# EAGLE design TPS61165 (EAGLE 9.6.2)
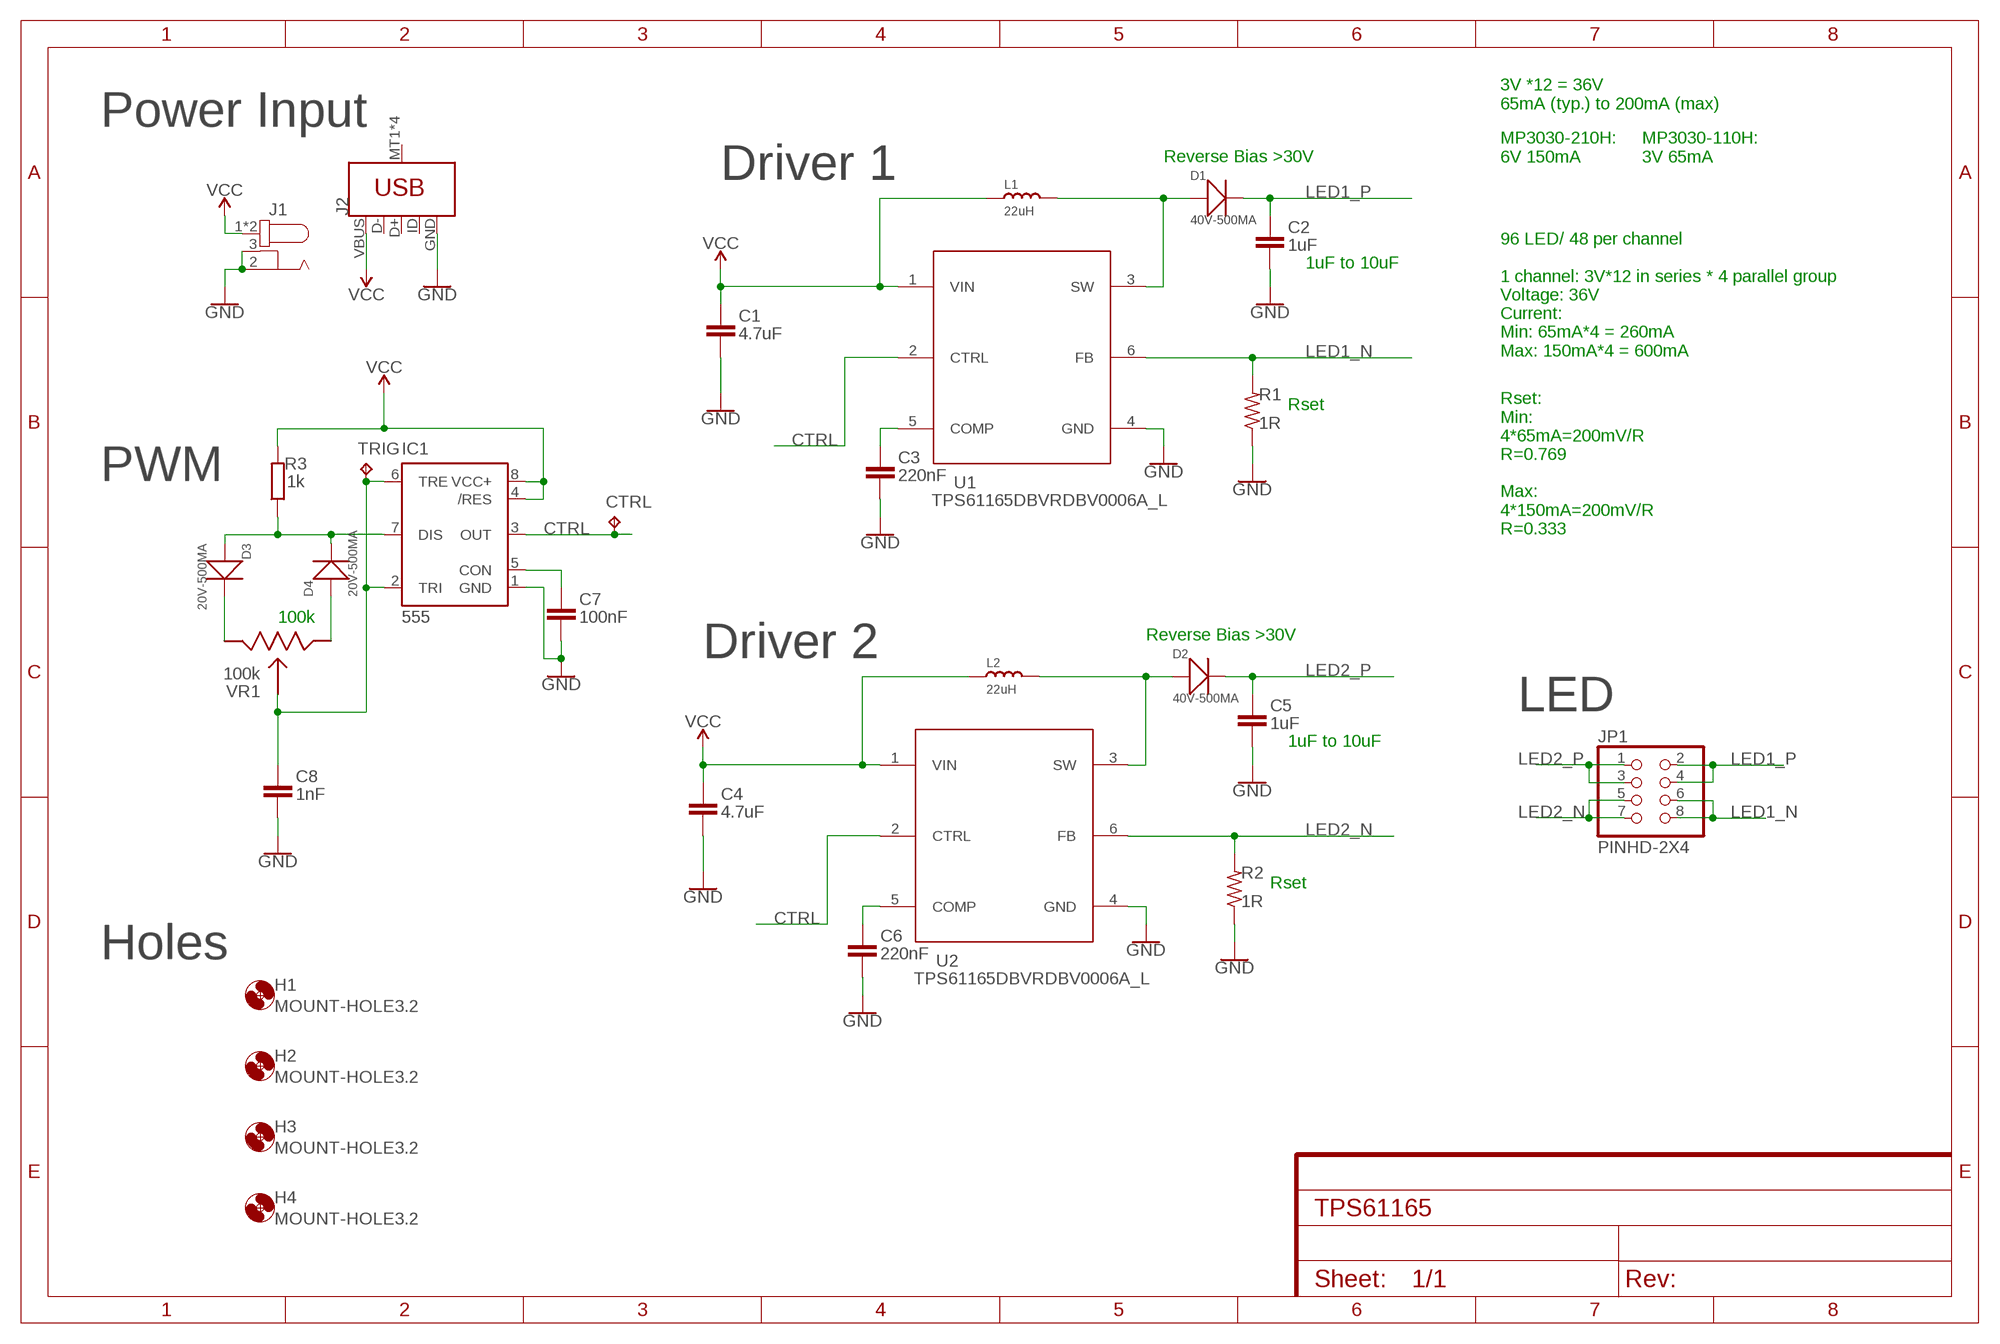
[diagram p0: schematic, sheet 1]

## Parts
C1  4.7uF  C_CHIP-0805(2012-METRIC)  [CAPC2012X110]
C2  1uF  C_CHIP-0805(2012-METRIC)  [CAPC2012X110]
C3  220nF  C_CHIP-0603(1608-METRIC)  [CAPC1608X85]
C4  4.7uF  C_CHIP-0805(2012-METRIC)  [CAPC2012X110]
C5  1uF  C_CHIP-0805(2012-METRIC)  [CAPC2012X110]
C6  220nF  C_CHIP-0603(1608-METRIC)  [CAPC1608X85]
C7  100nF  C_CHIP-0603(1608-METRIC)  [CAPC1608X85]
C8  1nF  C_CHIP-0603(1608-METRIC)  [CAPC1608X85]
CTRL  TPB1,27  [B1,27]
D1  40V-500MA  SMD-DIODE-SCHOTTKY-40V-500MA(SOD-123)  [SOD-123]
D2  40V-500MA  SMD-DIODE-SCHOTTKY-40V-500MA(SOD-123)  [SOD-123]
D3  20V-500MA  SMD-DIODE-SCHOTTKY-20V-500MA(SOD-123)  [SOD-123]
D4  20V-500MA  SMD-DIODE-SCHOTTKY-20V-500MA(SOD-123)  [SOD-123]
H1  MOUNT-HOLE3.2  [3,2]
H2  MOUNT-HOLE3.2  [3,2]
H3  MOUNT-HOLE3.2  [3,2]
H4  MOUNT-HOLE3.2  [3,2]
IC1  555  555D  [SO08]
J1  694108106102  [694108106102]
J2  USB_MICRO-B_SMT  [USB-MICROB]
JP1  PINHD-2X4  [2X04]
L1  22uH  SMD-INDUCTOR-10UH-20%(2P-6X6MM)'0630'  [SMD-2P-L6.0XW6.0XH3.0MM]
L2  22uH  SMD-INDUCTOR-10UH-20%(2P-6X6MM)'0630'  [SMD-2P-L6.0XW6.0XH3.0MM]
R1  1R  R-US_CHIP-1206(3216-METRIC)  [RESC3216X70]
R2  1R  R-US_CHIP-1206(3216-METRIC)  [RESC3216X70]
R3  1k  R_CHIP-0603(1608-METRIC)  [RESC1608X60]
TRIG  TPB1,27  [B1,27]
U1  TPS61165DBVRDBV0006A_L  [DBV0006A_L]
U2  TPS61165DBVRDBV0006A_L  [DBV0006A_L]
VR1  100k  5PIN-POT  [B104-5PIN]

## Nets
COMP: C3.1 U1.5(COMP)
COMP1: C6.1 U2.5(COMP)
CON: C7.1 IC1.5(CON)
CTRL: CTRL.TP IC1.3(OUT) U1.2(CTRL) U2.2(CTRL)
DISCHARGE: D3.+ D4.- IC1.7(DIS) R3.1
GND: C1.2 C2.2 C3.2 C4.2 C5.2 C6.2 C7.2 C8.2 IC1.1(GND) J1.2 J1.3 J2.GND R1.1 R2.1 U1.4(GND) U2.4(GND)
LED1_N: JP1.6 JP1.8 R1.2 U1.6(FB)
LED1_P: C2.1 D1.- JP1.2 JP1.4
LED2_N: JP1.5 JP1.7 R2.2 U2.6(FB)
LED2_P: C5.1 D2.- JP1.1 JP1.3
N$9: D3.- VR1.P$3
N$10: D4.+ VR1.P$1
SW: D1.+ L1.2 U1.3(SW)
SW1: D2.+ L2.2 U2.3(SW)
TRIGGER: C8.1 IC1.2(TRI) IC1.6(TRE) TRIG.TP VR1.NOT_P$2
VCC: C1.1 C4.1 IC1.4(/RES) IC1.8(VCC+) J1.1 J1.A1 J2.VBUS L1.1 L2.1 R3.2 U1.1(VIN) U2.1(VIN)
Unconnected: J2.D+ J2.D- J2.ID J2.MT1(SHIELD) J2.MT2(SHIELD) J2.P$1(SHIELD) J2.P$2(SHIELD)

## Notes on the sheet
- 3V *12 = 36V
  65mA (typ.) to 200mA (max)
- Power Input
- Reverse Bias >30V
- MP3030-210H:
  6V 150mA
- MP3030-110H:
  3V 65mA
- Driver 1
- 1uF to 10uF
- 96 LED/ 48 per channel
  
  1 channel: 3V*12 in series * 4 parallel group
  Voltage: 36V
  Current:
  Min: 65mA*4 = 260mA
  Max: 150mA*4 = 600mA
- Rset
- PWM
- Rset:
  Min:
  4*65mA=200mV/R
  R=0.769
  
  Max:
  4*150mA=200mV/R
  R=0.333
- 100k
- Reverse Bias >30V
- Driver 2
- LED
- 1uF to 10uF
- Rset
- Holes

## Library data of the parts
C1-C8 = Capacitor:C: Capacitor - Generic; CATEGORY: Capacitor
CTRL TRIG = testpad:TP: Test pad
D1 D2 = OPL_Discrete_Semiconductor:SMD-DIODE-SCHOTTKY-40V-500MA(SOD-123): 304020012; MPN: B0540W
D3 D4 = OPL_Discrete_Semiconductor:SMD-DIODE-SCHOTTKY-20V-500MA(SOD-123): 304020032; MPN: SS0520-7-F
H1-H4 = holes:MOUNT-HOLE: MOUNTING HOLE with drill center marker
IC1 = SparkFun-IC-Special-Function:555: General purpose bipolar Timer Datasheet <http://www.sparkfun.com/datasheets/Components/General/ne555.pdf> SparkFun Products SparkFun SparkPunk Sequencer Kit <https://www.sparkfun.com/products/12707> (KIT-12707) Storefront Component: 555 Timer <https://www.sparkfun.com/products/9273> (COM-09273) Two parts valid for production: VFP: IC-11930 (M7555 PTH) VFP: IC-09173 (555 PTH) - Preferred; PROD_ID: NA-XXXXX
J1 = Connector:694108106102: WR-DC DC Power Jack Right Angled SMT Ø 6.4 with 4 soldering pads & pegs Datasheet <https://katalog.we-online.com/en/em/DC_SMT_RIGHT_ANGLED_6_4_WITH_4_SOLDER_PADS_PEGS_69410X106102>; CATEGORY: Connector; DESCRIPTION: CONN PWR JACK 2.5X5.5MM SOLDER; MANUFACTURER: Würth Elektronik; MOUNT: SMT; MPN: 694108106102; OPERATING_TEMPERATURE: -40°C to +85°C; PART_STATUS: Active; ROHS_COMPLIANCE: RoHS Compliant; SERIES: WR-DC; SUBCATEGORY: Power Connector; TYPE: Barrel-Right Angled
J2 = SparkFun-Connectors:USB_MICRO-B: USB Type Micro-B Connector Male/female and PTH/SMT variants SparkFun Products: SparkFun microB USB Breakout <https://www.sparkfun.com/products/12035> SparkFun USB microB Plug Breakout <https://www.sparkfun.com/products/10031> SparkFun ESP8266 Thing <https://www.sparkfun.com/products/13231>; PROD_ID: CONN-09505; SF_ID: PRT-08533
JP1 = Connector:PINHD-2X4: PIN HEADER; CATEGORY: CONNECTOR; SUB-CATEGORY: PIN-HEADER
L1 L2 = OPL_Inductor:SMD-INDUCTOR-10UH-20%(2P-6X6MM): 303010016; MPN: CSAB0630-100M; VALUE: 10UH
R1 R2 = Resistor:R-US: Resistor Fixed - ANSI; CATEGORY: Resistor; SUB-CATEGORY: Fixed
R3 = Resistor:R: Resistor Fixed - Generic; CATEGORY: Resistor; SUB-CATEGORY: Fixed
U1 U2 = MP3030:TPS61165DBVR; COPYRIGHT: Copyright (C) 2021 Ultra Librarian. All rights reserved.; MANUFACTURER_PART_NUMBER: TPS61165DBVR; MFR_NAME: Texas Instruments; REFDES: RefDes; TYPE: TYPE
VR1 = MP3030:5PIN-POT

## Board
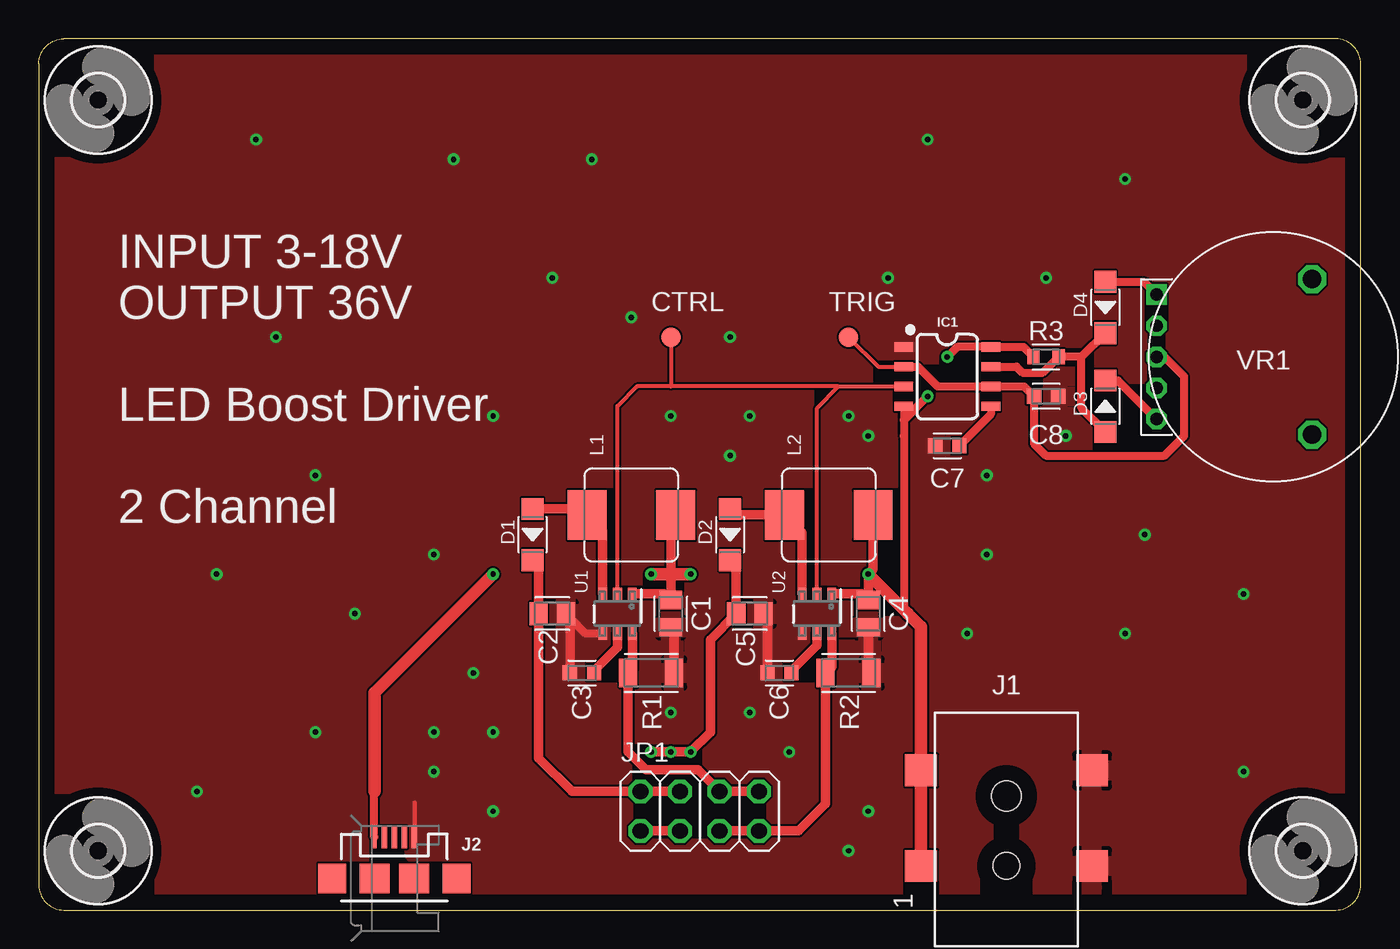
[diagram p1: board, top side]
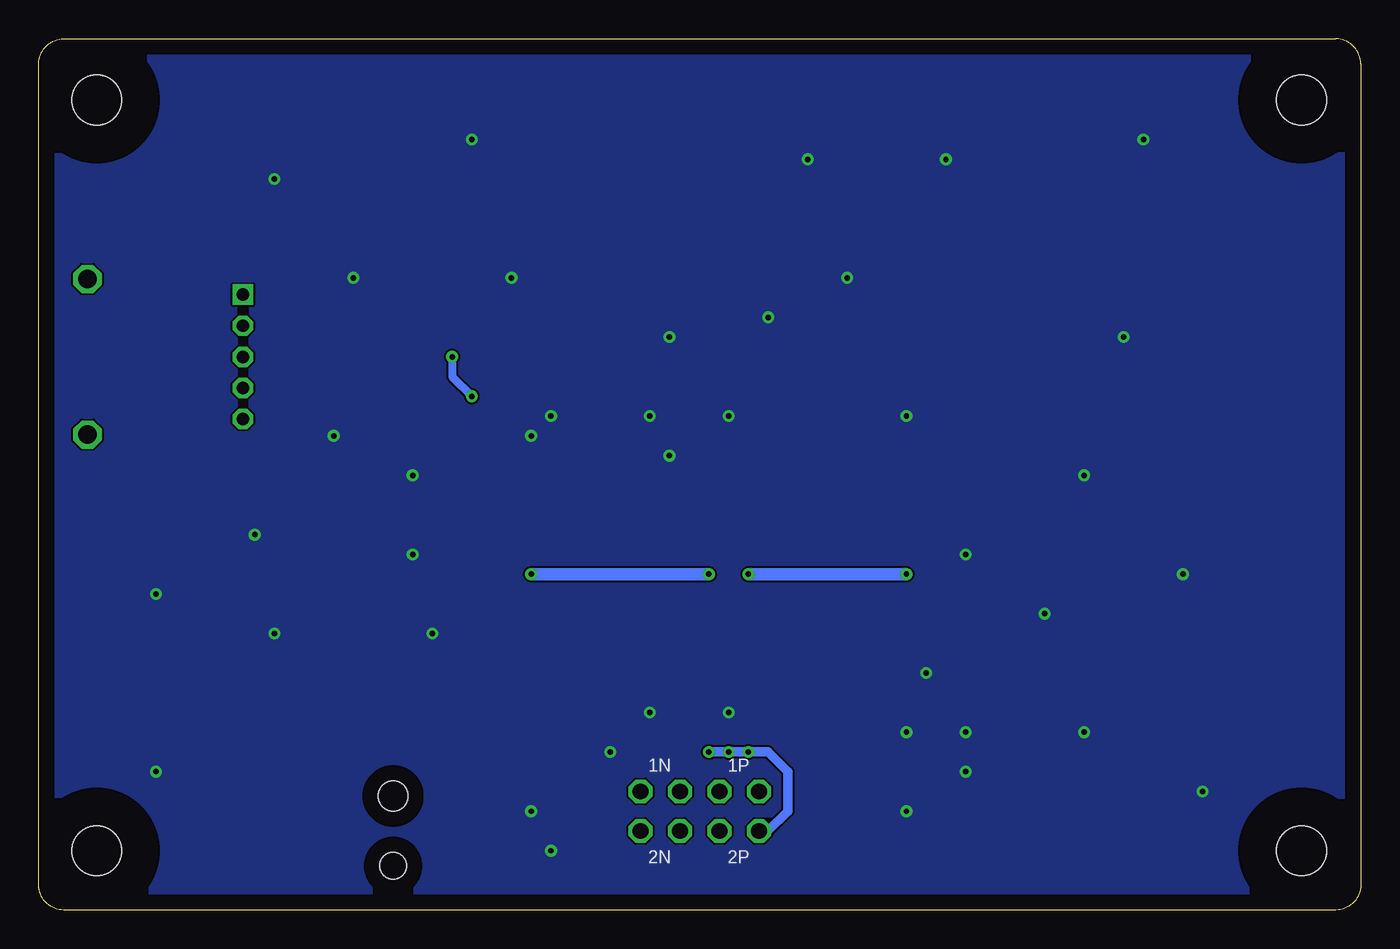
[diagram p2: board, bottom side, seen from below]

Size 85 x 56 mm. Coordinates in mm from the lower left corner, seen from the top.
Outline: 0,54.4 0,1.6 arc90 1.6,0 83.4,0 arc90 85,1.6 85,54.4 arc90 83.4,56 1.6,56 arc90 0,54.4
Copper layers (1*16): Top 0.035mm / dielectric 1.5mm / Bottom 0.035mm
Design rules "default *": minimum track width 6mil, minimum drill 0.35mm, track to track 5mil, track to pad 10mil, pad to pad 20mil, via to via 10mil, smd to smd 6mil, copper to edge 40mil, drill to drill 6mil, minimum pad ring 10mil, minimum via ring 8mil, stop-mask expansion 4mil, vias tented up to drill 0mil, thermal gap 10mil

### Footprints (pad centres in the part's own frame; a part is rotated, then mirrored left to right if it is on the bottom)
CAPC2012X110 = smd 1.165 x 1.465: 1 -0.875,0; 2 0.875,0
CAPC1608X85 = smd 0.921 x 0.97: 1 -0.775,0; 2 0.775,0
B1,27 = smd 1.27 x 1.27: TP 0,0
SOD-123 = smd 1.397 x 1.397: + -1.651,0; - 1.651,0
3,2 = hole 3.2: 0,0
SO08 = smd 0.6 x 1.2: 1 -1.905,-2.8; 2 -0.635,-2.8; 3 0.635,-2.8; 4 1.905,-2.8; 5 1.905,2.8; 6 0.635,2.8; 7 -0.635,2.8; 8 -1.905,2.8
694108106102 = smd 2.05 x 2.05: 1 -2.25,5.5; 2 -2.25,-5.5; 3 3.9,-5.5; A1 3.9,5.5 | hole 1.7: -2.25,0 | hole 1.9: 2.25,0
USB-MICROB = smd 1.4 x 0.35: D+ -2.65,0; D- -2.65,-0.65; GND -2.65,1.3; ID -2.65,0.65; VBUS -2.65,-1.3 | smd 1.9 x 1.8: MT1 0,-4; MT2 0,4 | smd 1.9 x 1.9: P$1 0,-1.27; P$2 0,1.27
2X04 = drill 1.016 octagon: 1 -3.81,-1.27; 2 -3.81,1.27; 3 -1.27,-1.27; 4 -1.27,1.27; 5 1.27,-1.27; 6 1.27,1.27; 7 3.81,-1.27; 8 3.81,1.27
SMD-2P-L6.0XW6.0XH3.0MM = smd 2.5 x 3.2: 1 -2.85,0; 2 2.85,0
RESC3216X70 = smd 1.165 x 1.815: 1 -1.475,0; 2 1.475,0
RESC1608X60 = smd 0.799 x 0.974: 1 -0.815,0; 2 0.815,0
DBV0006A_L = smd 0.8 x 0.55: 1 -1.275,0.95; 2 -1.275,0; 3 -1.275,-0.95; 4 1.275,-0.95; 5 1.275,0; 6 1.275,0.95
B104-5PIN = drill 1.2 octagon: NC1 -5,2.5; NC2 5,2.5 | drill 0.8 octagon: NOT_P$2 0,-7.5; NOT_P$3 2,-7.5; P$2 -2,-7.5; P$3 4,-7.5 | drill 0.8 square: P$1 -4,-7.5

### Placement (x,y rotation side)
C1  40.64,19.05 270 top
C2  33.02,19.05 0 top
C3  34.92,15.24 180 top
C4  53.34,19.05 270 top
C5  45.72,19.05 0 top
C6  47.62,15.24 180 top
C7  58.42,29.84 180 top
C8  64.77,33.02 0 top
CTRL  40.64,36.83 0 top
D1  31.75,24.13 270 top
D2  44.45,24.13 270 top
D3  68.58,32.38 90 top
D4  68.58,38.73 270 top
H1  3.81,3.81 0 top
H2  3.81,52.07 0 top
H3  81.28,52.07 0 top
H4  81.28,3.81 0 top
IC1  58.42,34.29 270 top
J1  62.23,5.08 90 top
J2  22.86,2.03 270 top
JP1  42.5,6.35 0 top
L1  38.1,25.4 180 top
L2  50.8,25.4 180 top
R1  39.37,15.24 180 top
R2  52.07,15.24 180 top
R3  64.77,35.56 180 top
TRIG  52.07,36.83 0 top
U1  37.21,19.05 270 top
U2  50.04,19.05 270 top
VR1  79.38,35.56 270 top

### Tracks (layer width: path | path; a pad name or v marks a point on that pad's centre or on a via)
COMP
  Top 0.61: C3.1 35.7,15.37 37.21,16.88 U1.5
COMP1
  Top 0.61: C6.1 48.4,15.37 50.04,17 U2.5
CON
  Top 0.508: IC1.5 61.22,31.87 C7.1
CTRL
  Top 0.254: U1.2 37.21,32.38 38.48,33.66 40.64,33.66 | U2.2 50.04,32.26 51.44,33.66 | 51.44,33.66 IC1.3 | 51.44,33.66 40.64,33.66 | CTRL.TP 40.64,33.66
DISCHARGE
  Top 0.508: D4.- 67.06,35.56 | 67.06,35.56 R3.1 64.56,34.54 63.26,34.54 62.88,34.92 IC1.7 | D3.+ 67.06,32.26 67.06,35.56
GND  (via drill 0.35)
  Top 0.305: J2.GND 24.16,6.89
  Top 0.508: U1.4 35.17,17.77 34.15,18.8
  Top 0.61: C3.2 34.15,18.8 C2.2 | C1.2 40.84,17.97 R1.1 | R2.1 53.34,15.45 C4.2 | C6.2 46.85,18.8 C5.2
  other vias: 25.4,22.86 20.32,19.05 17.78,11.43 27.94,15.24 25.4,11.43 25.4,8.89 29.21,11.43 29.21,6.35 59.69,17.78 69.85,17.78 60.96,22.86 71.12,24.13 40.64,31.75 45.72,31.75 44.45,29.21 53.34,30.48 52.07,31.75 60.96,27.94 66.04,30.48 64.77,40.64 54.61,40.64 44.45,36.83 38.1,38.1 29.21,31.75 17.78,27.94 40.64,12.7 45.72,12.7 48.26,10.16 53.34,6.35 52.07,3.81 10.16,7.62 11.43,21.59 15.24,36.83 33.02,40.64 13.97,49.53 35.56,48.26 57.15,49.53 26.67,48.26 69.85,46.99 77.47,20.32 77.47,8.89
  pour Top: -1.27,57.15 -1.27,-2.54 87.63,-2.54 87.63,57.15
  pour Bottom: -1.27,57.15 -1.27,-2.54 88.9,-2.54 88.9,58.42 -1.27,58.42
LED1_N
  Top 0.61: U1.6 38.16,15.51 R1.2 37.9,10.16 39.04,9.02 39.37,9.02 42.37,9.02 JP1.6 JP1.8
LED1_P
  Top 0.61: D1.- 32.15,22.08 C2.1 32.15,9.77 34.29,7.62 JP1.2 JP1.4
LED2_N
  Top 0.61: U2.6 50.99,15.63 R2.2 50.59,6.83 48.85,5.08 JP1.7 JP1.5
LED2_P  (via drill 0.35)
  Top 0.61: D2.- 44.84,22.08 C5.1 43.18,17.39 43.18,11.43 v41.91,10.16 v40.64,10.16 v39.37,10.16 | JP1.3 JP1.1
  Bottom 0.61: v41.91,10.16 38.1,10.16 36.83,8.89 36.83,6.35 38.1,5.08 JP1.1
N$9
  Top 0.508: VR1.P$3 69.4,34.04 D3.-
N$10
  Top 0.508: D4.+ 71.05,40.39 VR1.P$1
SW
  Top 0.61: U1.3 36.26,24.39 L1.2 34.87,25.78 D1.+
SW1
  Top 0.61: U2.3 49.09,24.26 L2.2 44.83,25.4 D2.+
TRIGGER
  Top 0.254: TRIG.TP 53.98,34.92 IC1.2
  Top 0.508: IC1.2 56.52,34.92 57.78,33.66 IC1.6 63.36,33.66 C8.1 63.99,29.98 64.77,29.21 72.39,29.21 73.66,30.48 73.66,34.29 72.39,35.56 VR1.NOT_P$2
VCC  (via drill 0.35)
  Top 0.508: R3.2 63.32,36.2 IC1.8 59.05,36.2 v58.42,35.56 | J2.VBUS 21.56,7.59 21.59,7.62 | IC1.4 55.62,31.49 | 55.88,19.05 55.62,19.31 55.62,30.48 55.62,31.49 | v57.15,33.02 55.62,31.49
  Top 0.61: L1.1 40.64,25.09 40.64,21.59 C1.1 40.24,20.32 U1.1 | U2.1 52.94,20.32 C4.1 v53.34,21.59 53.65,21.9 L2.1
  Top 0.813: J1.1 J1.A1 56.73,18.2 55.88,19.05 v53.34,21.59 | v41.91,21.59 40.64,21.59 v39.37,21.59 | 21.59,7.62 21.59,13.97 v29.21,21.59
  Bottom 0.508: v58.42,35.56 58.42,34.29 v57.15,33.02
  Bottom 0.813: v41.91,21.59 v53.34,21.59 | v39.37,21.59 v29.21,21.59

### Text on the board
tNames: INPUT 3-18V / OUTPUT 36V / / LED Boost Driver / / 2 Channel
bNames: 1P | 1N | 2P | 2N